# EasyEDA Pro project ProProject_2.4G Wireless_2024-12-04.epro, board PCB_2.4g 无线接收板 copy
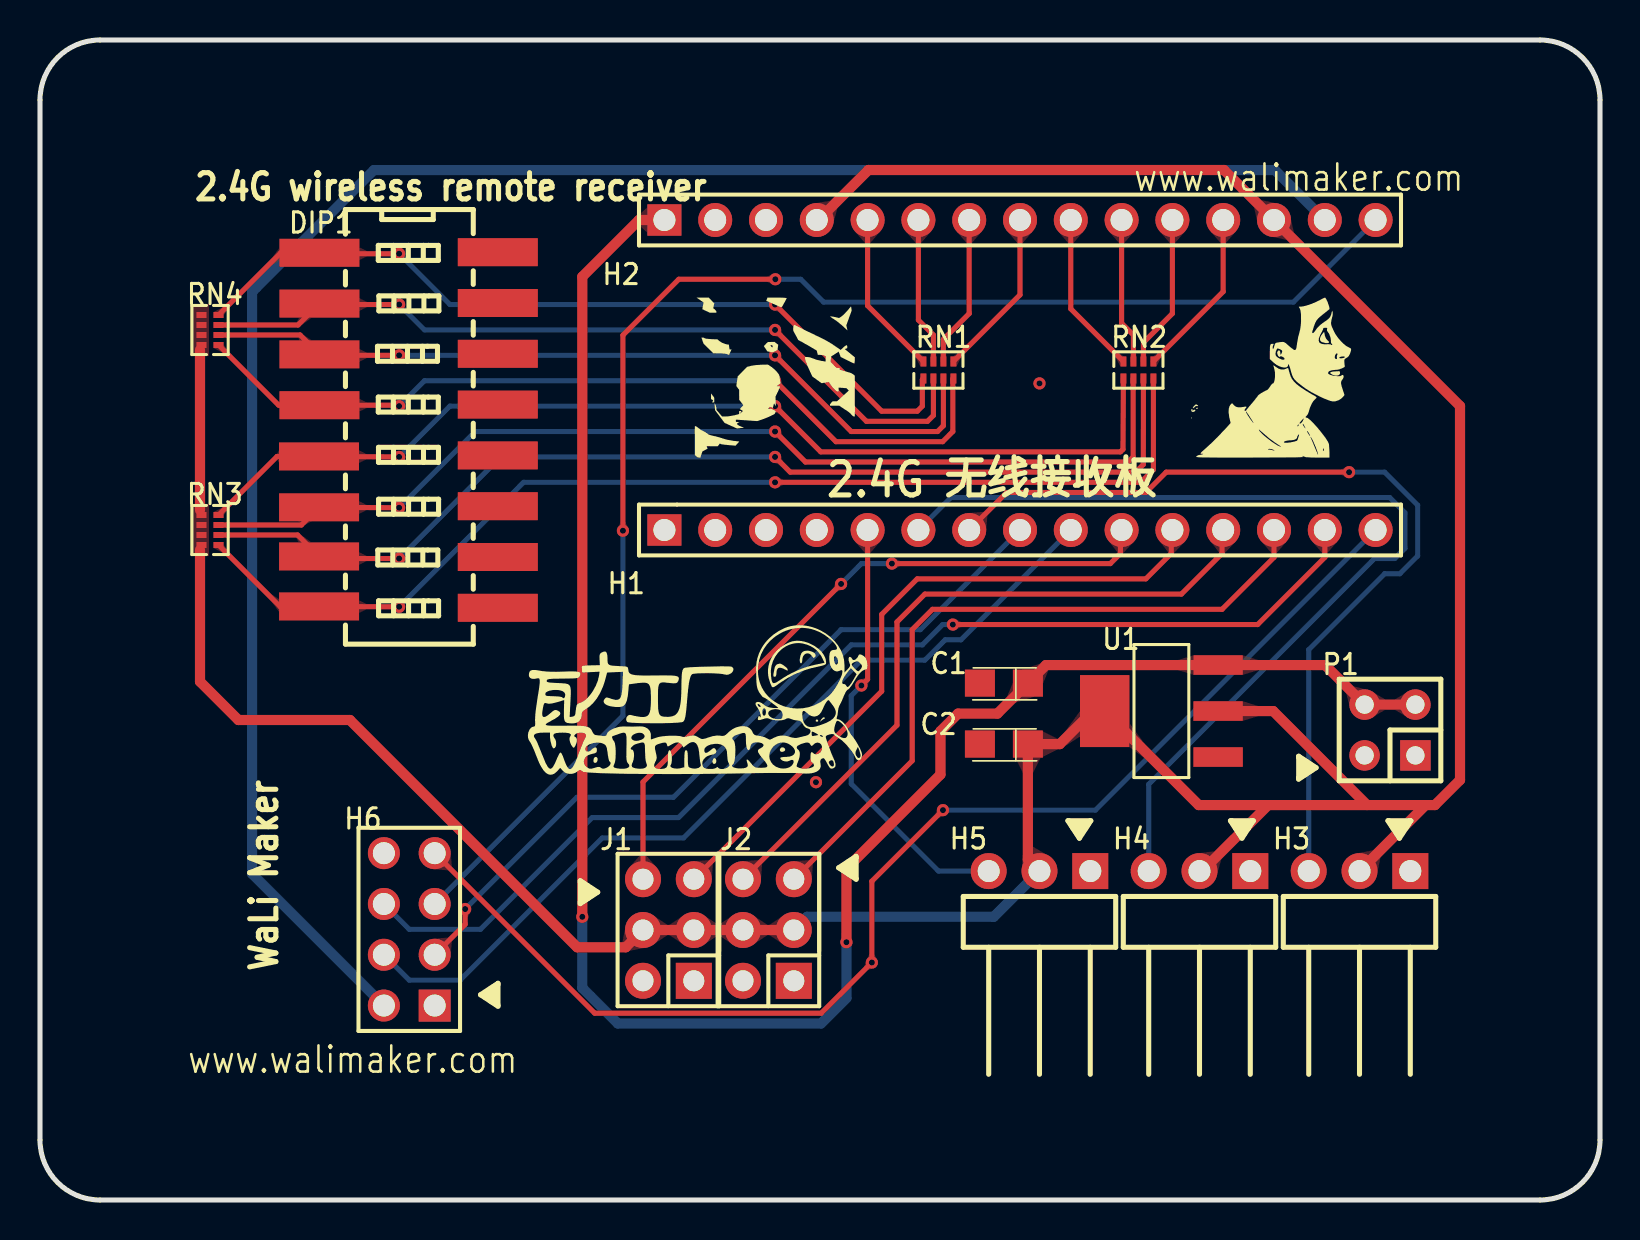
[diagram p6: board, top side]
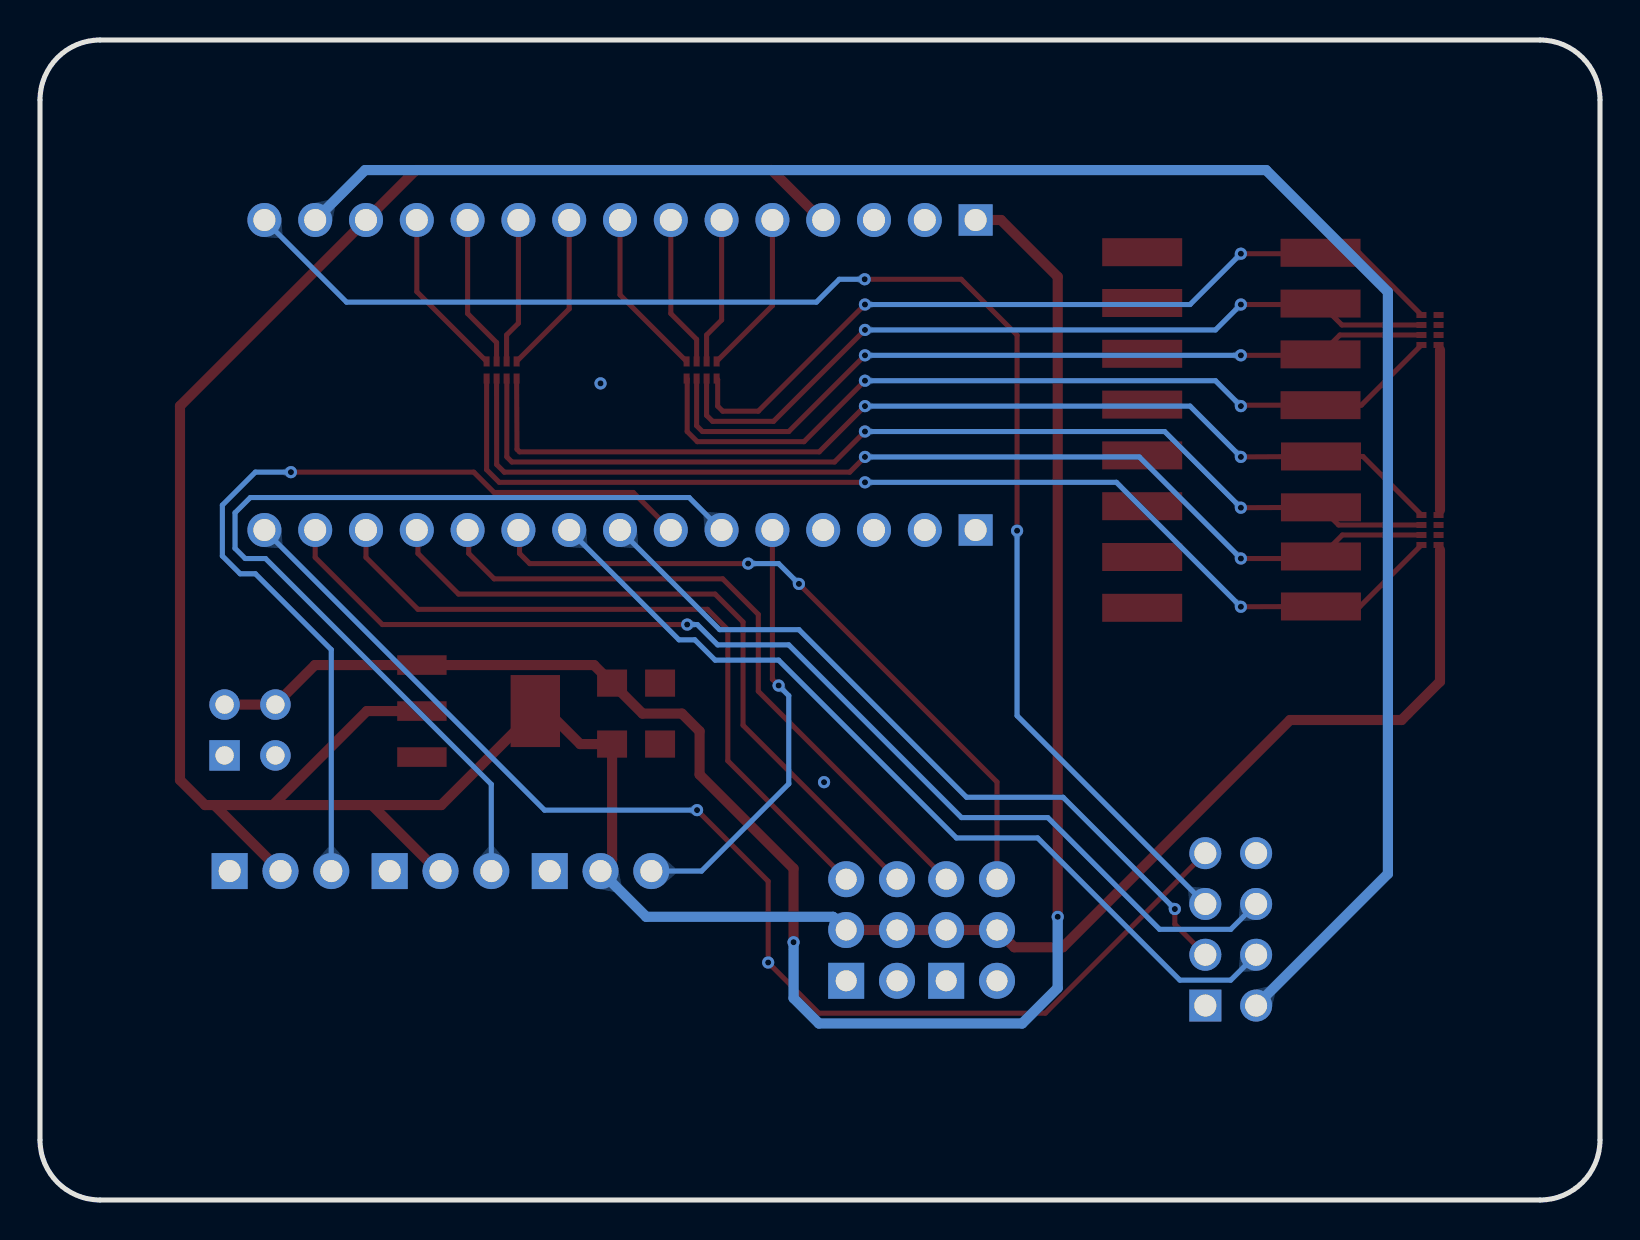
[diagram p7: board, bottom side, seen from below]

Outline 78 x 58 mm; copper layers: Top Layer, Bottom Layer. Coordinates in mm from the lower left corner of the outline.
Outline path: 0,55 arc(0.88,57.12) 3,58 75,58 arc(77.12,57.12) 78,55 78,3 arc(77.12,0.88) 75,0 3,0 arc(0.88,0.88) 0,3 0,55
Stack: Top Layer 0.035mm / Dielectric1 1.51mm FR4 er 4.5 / Bottom Layer 0.035mm

## Design rules (mm)
spacing Default (default): track to track 0.152, other pairs 0 to 0.152
track width Default (default): min 0.254, default 0.254, max 25.4
differential pair differentialPair (default): width min 0.127, default 0.254, max 2.54; gap min 0.152, default 0.152
via Default (default): diameter min 0.61, default 0.61, max 100.025; hole min 0.305, default 0.305, max 59.995
net GND uses gge2180
pour e410 uses gge2180

## Placement (name value [footprint] x y rotation side)
C1  10u  [CASE-A_3216]  48.2 25.84 180 top
C2  10u  [CASE-A_3216]  48.2 22.8 180 top
DIP1  HAD-08HWA-R  [SW-SMD_16P-L21.4-W6.4-P2.54-LS9.8]  18.42 38.5 270 top
H1  H(F)-2.54_1x15  [HDR-TH_15P-P2.54-V]  49 33.5 0 top
H2  H(F)-2.54_1x15  [HDR-TH_15P-P2.54-V]  49 49 0 top
H3  A2541WR-3P  [HDR-TH_3P-P2.54-H-M-W10.0]  65.98 16.45 180 top
H4  A2541WR-3P  [HDR-TH_3P-P2.54-H-M-W10.0]  57.97 16.45 180 top
H5  A2541WR-3P  [HDR-TH_3P-P2.54-H-M-W10.0]  49.97 16.45 180 top
H6  H(F)-2.54_2x4  [HDR-TH_8P-P2.54-V-R2-C4-S2.54]  18.46 13.53 90 top
J1  Header-Male-2.54_2x3  [HDR-TH_6P-P2.54-V-R2-C3-S2.54]  31.42 13.5 90 top
J2  Header-Male-2.54_2x3  [HDR-TH_6P-P2.54-V-R2-C3-S2.54]  36.42 13.5 90 top
P1  Header-Male-2.54_2x2  [HDR-TH_4P-P2.54-V-R2-C2-S2.54]  67.5 23.5 90 top
RN1  220  [RES-ARRAY-SMD_0402-8P-L2.0-W1.0-BL]  44.92 41.5 0 top
RN2  220  [RES-ARRAY-SMD_0402-8P-L2.0-W1.0-BL]  54.92 41.5 0 top
RN3  4.7K  [RES-ARRAY-SMD_0402-8P-L2.0-W1.0-BL]  8.5 33.5 270 top
RN4  4.7K  [RES-ARRAY-SMD_0402-8P-L2.0-W1.0-BL]  8.5 43.5 270 top
U1  LM1117MPX-5.0/NOPB  [SOT-223-4_L6.5-W3.5-P2.30-LS7.0-BR]  56.07 24.45 0 top

## Footprints (pads in the part's own frame, mm; a bottom-side part is the same pattern mirrored in y, then rotated)
CASE-A_3216
  rect 1.5x1.359 smd: 1(-1.2,0) 2(1.2,0)
HDR-TH_3P-P2.54-H-M-W10.0
  rect 1.8x1.8 hole 1.1: 1(-2.54,0)
  round 1.8 hole 1.1: 2(0,0) 3(2.54,0)
HDR-TH_4P-P2.54-V-R2-C2-S2.54
  rect 1.524x1.524 hole 0.914: 1(-1.27,-1.27)
  round 1.524 hole 0.914: 2(-1.27,1.27) 3(1.27,-1.27) 4(1.27,1.27)
HDR-TH_6P-P2.54-V-R2-C3-S2.54
  rect 1.8x1.8 hole 1.05: 1(-2.54,-1.27)
  round 1.8 hole 1.05: 2(-2.54,1.27) 3(0,-1.27) 4(0,1.27) 5(2.54,-1.27) 6(2.54,1.27)
HDR-TH_8P-P2.54-V-R2-C4-S2.54
  rect 1.6x1.6 hole 1.1: 1(-3.81,-1.27)
  round 1.6 hole 1.1: 2(-3.81,1.27) 3(-1.27,-1.27) 4(-1.27,1.27) 5(1.27,-1.27) 6(1.27,1.27) 7(3.81,-1.27) 8(3.81,1.27)
HDR-TH_15P-P2.54-V
  rect 1.7x1.575 hole 1.1: 1(-17.78,0)
  round 1.7 hole 1.1: 2(-15.24,0) 3(-12.7,0) 4(-10.16,0) 5(-7.62,0) 6(-5.08,0) 7(-2.54,0) 8(0,0) 9(2.54,0) 10(5.08,0) 11(7.62,0) 12(10.16,0) 13(12.7,0) 14(15.24,0) 15(17.78,0)
RES-ARRAY-SMD_0402-8P-L2.0-W1.0-BL
  rect 0.3x0.505 smd: 1(-0.75,0.427) 2(-0.25,0.427) 3(0.25,0.427) 4(0.75,0.427) 5(0.75,-0.427) 6(0.25,-0.427) 7(-0.25,-0.427) 8(-0.75,-0.427)
SOT-223-4_L6.5-W3.5-P2.30-LS7.0-BR
  rect 2.47x0.98 smd: 1(2.835,-2.3) 2(2.835,0) 3(2.835,2.3)
  rect 2.47x3.6 smd: 4(-2.835,0)
SW-SMD_16P-L21.4-W6.4-P2.54-LS9.8
  rect 1.4x4 smd: 1(-8.861,-4.447) 2(-6.321,-4.447) 3(-3.781,-4.447) 4(-1.241,-4.447) 5(1.322,-4.47) 6(3.866,-4.467) 7(6.324,-4.467) 8(8.823,-4.467) 9(8.89,4.47) 10(6.35,4.47) 11(3.81,4.47) 12(1.27,4.47) 13(-1.27,4.47) 14(-3.81,4.47) 15(-6.35,4.47) 16(-8.89,4.47)

## Nets
+5V: C2.1 H2.4 H2.13 H3.2 H4.2 H5.2 J1.3 J1.4 J2.3 J2.4 RN3.5 RN3.6 RN3.7 RN3.8 RN4.5 RN4.6 RN4.7 RN4.8 U1.2 U1.4
GND: C1.2 C2.2 DIP1.9 DIP1.10 DIP1.11 DIP1.12 DIP1.13 DIP1.14 DIP1.15 DIP1.16 H1.4 H2.2 H3.1 H4.1 H5.1 H6.1 J1.1 J1.2 J2.1 J2.2 P1.1 P1.2 U1.1
VCC: C1.1 H2.1 P1.3 P1.4 U1.3
DIP1_1: DIP1.1 RN1.8 RN4.1
DIP1_2: DIP1.2 RN1.7 RN4.2
DIP1_3: DIP1.3 RN1.6 RN4.3
DIP1_4: DIP1.4 RN1.5 RN4.4
DIP1_5: DIP1.5 RN2.8 RN3.1
DIP1_6: DIP1.6 RN2.7 RN3.2
DIP1_7: DIP1.7 RN2.6 RN3.3
DIP1_8: DIP1.8 RN2.5 RN3.4
H1_1: H1.1
H1_2: H1.2
H1_3: H1.3
H1_5: H1.5 H5.3
H1_6: H1.6 H4.3
H1_7: H1.7 H3.3
H1_8: H1.8 H6.3
H1_9: H1.9 H6.4
H1_10: H1.10 J1.6
H1_11: H1.11 J1.5
H1_12: H1.12 J2.6
H1_13: H1.13 J2.5
H1_14: H1.14 H6.6
H1_15: H1.15 H6.7
H2_3: H2.3
H2_5: H2.5 RN1.1
H2_6: H2.6 RN1.2
H2_7: H2.7 RN1.3
H2_8: H2.8 RN1.4
H2_9: H2.9 RN2.1
H2_10: H2.10 RN2.2
H2_11: H2.11 RN2.3
H2_12: H2.12 RN2.4
H2_14: H2.14 H6.2
H2_15: H2.15 H6.5
H6_8: H6.8

## Via types
v1: diameter 0.61, hole 0.305, Top Layer to Bottom Layer, 30 vias

## Routing (per net, layer and track width the routed paths; a pad name or vN(x,y) marks a point on that pad's centre or on a via; arc(x,y) is an arc through that point)
+5V: length 170.6
  Top Layer w0.508: J2.3 J2.4 J1.3 J1.4 29.29,12.64 26.86,12.64 15.5,24 9.92,24 8,25.92 8,32.5 ; 58.91,24.45 61.66,24.45 66.35,19.75 ; 61.41,19.75 58.11,16.45 H4.2 ; H2.4 38.92,49 41.42,51.5 59.2,51.5 H2.13 71,39.7 71,21 69.75,19.75 57.93,19.75 53.24,24.45 52.64,24.45 50.99,22.8 C2.1 49.4,17.02 H5.2 ; H3.2 69.28,19.75 ; 8,34.5 8,42.5
  Bottom Layer w0.508: H5.2 47.69,14.16 38.35,14.16 J2.3
GND:
  vias: v1(38.8,20.89) v1(49.97,40.83)
VCC: length 96.5
  Top Layer w0.508: H2.1 29.95,49 27.11,46.16 v1(27.11,14.16) ; 66.23,24.77 64.25,26.75 U1.3 50.3,26.75 C1.1 47.87,24.32 45.9,24.32 45.02,23.44 45.02,21.27 40.32,16.57 v1(40.32,12.89) ; P1.3 P1.4
  Bottom Layer w0.508: v1(27.11,14.16) 27.11,10.6 28.89,8.83 39.05,8.83 40.32,10.1 v1(40.32,12.89)
DIP1_1: length 41.3
  Top Layer w0.254: 44.17,41.07 44.12,41.02 44.12,39.69 43.86,39.44 42.09,39.44 v1(36.75,44.77) ; 8.93,44.25 12.04,47.36 DIP1.1 14.02,47.31 v1(17.95,47.31)
  Bottom Layer w0.254: v1(17.96,47.31) 20.5,44.77 v1(36.75,44.77)
DIP1_2: length 40.6
  Top Layer w0.254: RN4.2 12.9,43.75 DIP1.2 14.02,44.77 v1(17.95,44.77) ; 44.67,41.07 44.67,39.23 44.37,38.93 41.32,38.93 v1(36.75,43.5)
  Bottom Layer w0.254: v1(36.75,43.5) 19.23,43.5 v1(17.96,44.77)
DIP1_3: length 40.7
  Top Layer w0.254: v1(17.95,42.23) 14.02,42.23 DIP1.3 13,43.25 RN4.3 ; v1(36.75,42.23) 40.56,38.42 44.88,38.42 45.17,38.71 45.17,41.07
  Bottom Layer w0.254: v1(17.96,42.23) v1(36.75,42.23)
DIP1_4: length 42.6
  Top Layer w0.254: 45.67,41.07 45.64,41.05 45.64,38.42 45.13,37.92 39.8,37.92 v1(36.75,40.96) ; RN4.4 11.94,39.74 DIP1.4 17.91,39.74 v1(17.95,39.69)
  Bottom Layer w0.254: v1(17.96,39.69) 19.23,40.96 v1(36.75,40.96)
DIP1_5: length 52
  Top Layer w0.254: v1(36.75,39.69) 39.04,37.41 54.02,37.41 54.15,37.53 54.17,41.07 ; 8.93,34.25 11.85,37.18 13.95,37.18 v1(17.95,37.15)
  Bottom Layer w0.254: v1(36.75,39.69) 20.5,39.69 v1(17.96,37.15)
DIP1_6: length 52.3
  Top Layer w0.254: v1(36.75,38.42) 38.28,36.9 54.4,36.9 54.66,37.15 54.66,41.07 ; v1(17.95,34.61) DIP1.6 13.07,33.75 RN3.2
  Bottom Layer w0.254: v1(36.75,38.42) 21.77,38.42 v1(17.96,34.61)
DIP1_7: length 53.6
  Top Layer w0.254: RN3.3 12.88,33.25 DIP1.7 14.06,32.07 v1(17.95,32.07) ; 55.17,41.07 55.17,36.77 54.78,36.39 37.51,36.39 v1(36.75,37.15)
  Bottom Layer w0.254: v1(17.96,32.07) 23.04,37.15 v1(36.75,37.15)
DIP1_8: length 55.4
  Top Layer w0.254: v1(17.95,29.66) DIP1.8 12,29.68 RN3.4 ; v1(36.75,35.88) 55.04,35.88 55.67,36.51 55.67,41.07
  Bottom Layer w0.254: v1(17.96,29.66) 24.18,35.88 v1(36.75,35.88)
H1_5: length 21.7
  Top Layer w0.254: H1.5 41.38,26.03 v1(41.07,25.72)
  Bottom Layer w0.254: 41.07,25.72 40.56,25.22 40.56,20.81 44.92,16.45 H5.3
H1_6: length 49.1
  Bottom Layer w0.254: H1.6 45.54,35.12 67.49,35.12 68.25,34.36 68.25,32.58 67.74,32.07 66.72,32.07 55.44,20.78 H4.3
H1_7: length 45.3
  Top Layer w0.254: v1(65.45,36.39) 56.31,36.39 55.29,35.38 48.34,35.38 H1.7
  Bottom Layer w0.254: v1(65.45,36.39) 67.23,36.39 68.88,34.74 68.88,32.2 67.99,31.31 67.23,31.31 63.44,27.52 H3.3
H1_8: length 38.5
  Top Layer w0.254: v1(21.26,14.55) 21.26,13.79 H6.3
  Bottom Layer w0.254: v1(21.26,14.55) 26.85,20.14 31.67,20.14 40.05,28.52 44.02,28.52 H1.8
H1_9: length 44.2
  Bottom Layer w0.254: H6.4 18.46,10.99 21,10.99 28.12,18.1 32.18,18.1 41.07,26.99 44.24,26.99 45.26,28.01 46.05,28.01 H1.9
H1_10: length 34.7
  Top Layer w0.254: v1(42.59,31.82) 53.51,31.82 54.02,32.33 54.02,33.44 H1.10 ; v1(40.05,30.8) 30.15,20.9 J1.6
  Bottom Layer w0.254: v1(40.05,30.8) 41.07,31.82 v1(42.59,31.82)
H1_11: length 34.1
  Top Layer w0.254: J1.5 42.09,25.44 42.09,29.28 43.86,31.06 55.29,31.06 56.56,32.33 56.56,33.44 H1.11
H1_12: length 34.9
  Top Layer w0.254: J2.6 42.85,23.74 42.85,28.9 44.25,30.3 57.07,30.3 59.1,32.33 59.1,33.44 H1.12
H1_13: length 35.9
  Top Layer w0.254: H1.13 61.7,32.13 59.1,29.53 44.63,29.53 43.61,28.52 43.61,21.96 J2.5
H1_14: length 56.6
  Top Layer w0.254: H1.14 64.24,32.13 60.88,28.77 v1(45.64,28.77)
  Bottom Layer w0.254: H6.6 18.46,13.53 22.02,13.53 27.61,19.12 31.93,19.12 40.56,27.76 44.12,27.76 45.13,28.77 45.64,28.77
H1_15: length 62.8
  Top Layer w0.254: 19.73,17.34 27.73,9.34 39.06,9.34 v1(41.59,11.87) 41.59,15.94 v1(45.15,19.49)
  Bottom Layer w0.254: 66.78,33.4 H1.15 52.77,19.49 v1(45.15,19.49)
H2_5: length 8.2
  Top Layer w0.254: H2.5 41.38,44.72 RN1.1
H2_6: length 7.4
  Top Layer w0.254: RN1.2 44.67,43.25 43.92,44 H2.6
H2_7: length 7.6
  Top Layer w0.254: 45.17,41.93 45.17,43.03 46.46,44.32 H2.7
H2_8: length 8.5
  Top Layer w0.254: H2.8 49,45.26 45.67,41.93
H2_9: length 8.2
  Top Layer w0.254: H2.9 51.54,44.56 RN2.1
H2_10: length 7.3
  Top Layer w0.254: H2.10 54.08,43.84 54.67,43.25 RN2.2
H2_11: length 7.7
  Top Layer w0.254: 55.17,41.93 55.17,42.87 56.62,44.32 H2.11
H2_12: length 8.5
  Top Layer w0.254: H2.12 59.16,45.42 55.67,41.93
H2_14: length 95.6
  Bottom Layer w0.508: 17.19,9.72 10.6,16.31 10.6,45.4 16.7,51.5 61.74,51.5 H2.14
H2_15: length 73.3
  Top Layer w0.254: v1(36.77,46.04) 31.94,46.04 29.15,43.24 v1(29.15,33.46)
  Bottom Layer w0.254: v1(36.77,46.04) 38.04,46.04 39.18,44.89 62.67,44.89 H2.15 ; H6.5 29.15,24.21 v1(29.15,33.46)

## Copper pours and planes (outline as drawn; the poured copper is in the pictures)
+5V on Top Layer: 7.55,44.8 8.45,44.8 8.45,42.2 7.55,42.2
+5V on Top Layer: 7.55,34.8 8.45,34.8 8.45,32.2 7.55,32.2
GND on Top Layer: 82.42,-3.5 82.42,61.5 -2.58,61.5 -2.58,-3.5
GND on Bottom Layer: 87.42,-8.5 87.42,66.5 -7.58,66.5 -7.58,-8.5

Small or netless copper shapes (teardrops, artwork), in the pictures only: 114 on Top Layer, 42 on Bottom Layer

## Text on the board
Top Silkscreen Layer: www.walimaker.com | 2.4G wireless remote receiver | WaLi Maker | ▶ | 2.4G 无线接收板
